# Altium schematic sheet senror_input.SchDoc
size A3
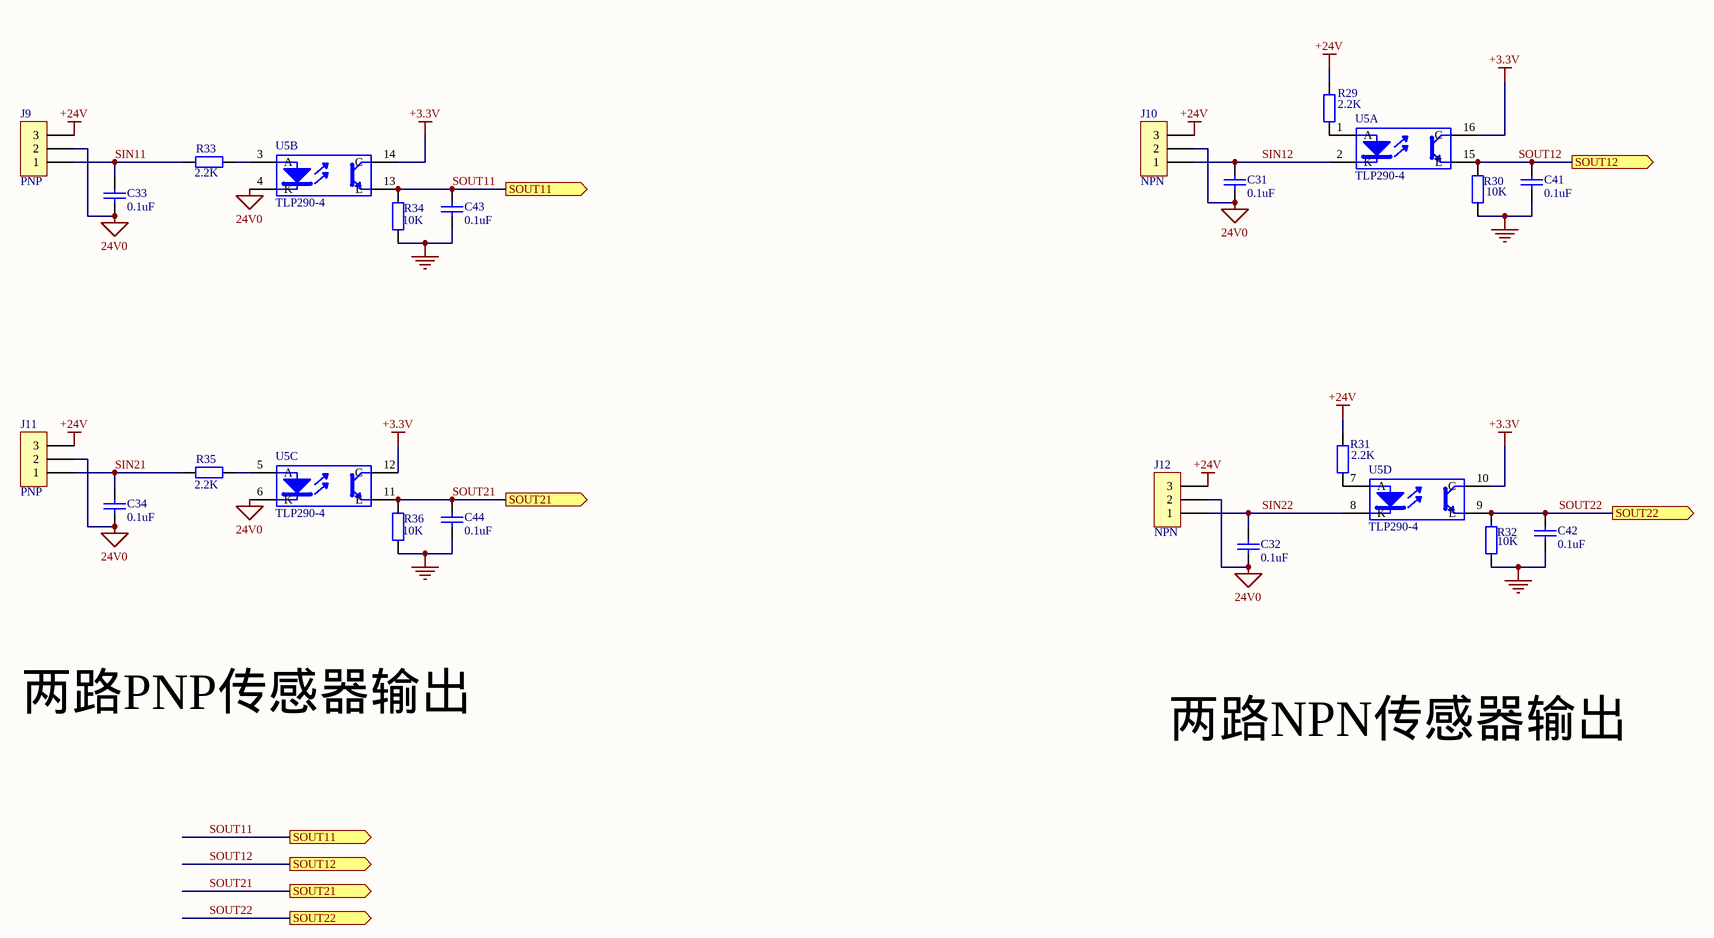
[diagram p0: senror_input.SchDoc]

## Parts
C31  0.1uF  [0805_CAP]
C32  0.1uF  [0805_CAP]
C33  0.1uF  [0805_CAP]
C34  0.1uF  [0805_CAP]
C41  0.1uF  [0805_CAP]
C42  0.1uF  [0805_CAP]
C43  0.1uF  [0805_CAP]
C44  0.1uF  [0805_CAP]
J9  HEADER1X3  [VH3.96_3P]  (value not drawn)
J10  HEADER1X3  [VH3.96_3P]  (value not drawn)
J11  HEADER1X3  [VH3.96_3P]  (value not drawn)
J12  HEADER1X3  [VH3.96_3P]  (value not drawn)
R29  2.2K  [0805_RES]
R30  10K  [0805_RES]
R31  2.2K  [0805_RES]
R32  10K  [0805_RES]
R33  2.2K  [0805_RES]
R34  10K  [0805_RES]
R35  2.2K  [0805_RES]
R36  10K  [0805_RES]
U5  TLP290-4  [SO16]  (parts A,B,C,D of 4)

## Ports
SOUT11 (out), SOUT12 (out), SOUT21 (out), SOUT22 (out)

## Nets
24V0: C31.2 C32.2 C33.2 C34.2 J9.2 J10.2 J11.2 J12.2 U5.4(K) U5.6(K)
+3.3V: U5.10(C) U5.12(C) U5.14(C) U5.16(C)
+24V: J9.3 J10.3 J11.3 J12.3 R29.1 R31.1
GND: C41.2 C42.2 C43.2 C44.2 R30.2 R32.2 R34.2 R36.2
SIN11: C33.1 J9.1 R33.1
SIN12: C31.1 J10.1 U5.2(K)
SIN21: C34.1 J11.1 R35.1
SIN22: C32.1 J12.1 U5.8(K)
SOUT11: C43.1 R34.1 U5.13(E) ; port SOUT11
SOUT12: C41.1 R30.1 U5.15(E) ; port SOUT12
SOUT21: C44.1 R36.1 U5.11(E) ; port SOUT21
SOUT22: C42.1 R32.1 U5.9(E) ; port SOUT22
NetR29_2: R29.2 U5.1(A)
NetR31_2: R31.2 U5.7(A)
NetR33_2: R33.2 U5.3(A)
NetR35_2: R35.2 U5.5(A)

## Notes on the sheet
- 两路PNP传感器输出
- 两路NPN传感器输出
- (in symbol HEADER1X3) PNP; NPN

## Library data of the parts
C31-C34 C41-C44 = Cap: Capacitor; Published: 8-Jun-2000; LatestRevisionDate: 17-Jul-2002; LatestRevisionNote: Re-released for DXP Platform.; PackageReference: RAD-0.3; Publisher: Altium Limited; Value: 0.1uF
R29 R31 R33-R36 = Res2: Resistor; Published: 8-Jun-2000; LatestRevisionDate: 17-Jul-2002; LatestRevisionNote: Re-released for DXP Platform.; PackageReference: AXIAL-0.4; Publisher: Altium Limited
  R29 R31 R33 R35: Value: 2.2K
  R34 R36: Value: 10K
R30 R32 = Res2: Resistor; Value: 1K; Published: 8-Jun-2000; LatestRevisionDate: 17-Jul-2002; LatestRevisionNote: Re-released for DXP Platform.; PackageReference: AXIAL-0.4; Publisher: Altium Limited
U5 = TLP521-4